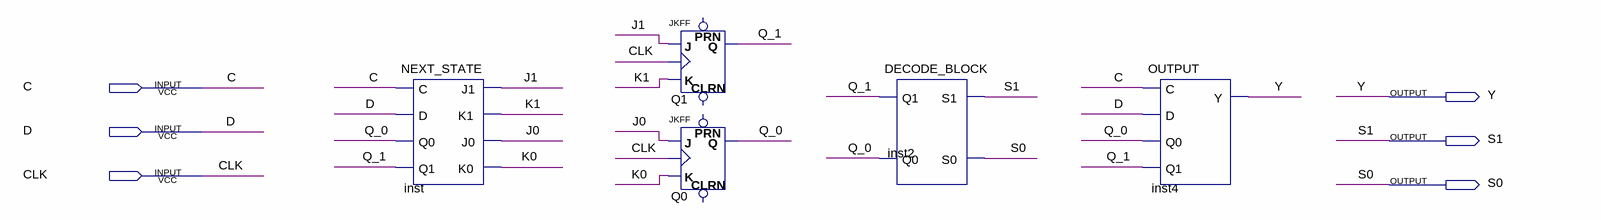
[diagram p0: schematic sheet]
// Quartus schematic modulo_3_updown_counter.bdf as structural Verilog: 5 symbols, 6 pins
module modulo_3_updown_counter (
  input  C,
  input  D,
  input  CLK,
  output Y,
  output S1,
  output S0
);

  wire J0, J1, K0, K1, Q_0, Q_1;

  NEXT_STATE inst (.C(C), .D(D), .Q0(Q_0), .Q1(Q_1), .J0(J0), .K1(K1), .K0(K0), .J1(J1));
  JKFF Q1 (.K(K1), .J(J1), .CLK(CLK), .Q(Q_1));  // open: PRN, CLRN
  JKFF Q0 (.K(K0), .J(J0), .CLK(CLK), .Q(Q_0));  // open: PRN, CLRN
  DECODE_BLOCK inst2 (.Q1(Q_1), .Q0(Q_0), .S1(S1), .S0(S0));
  OUTPUT inst4 (.C(C), .D(D), .Q0(Q_0), .Q1(Q_1), .Y(Y));
endmodule
